# Altium schematic sheet Main.SchDoc
size A3; SheetNumber: 1; SheetTotal: 5
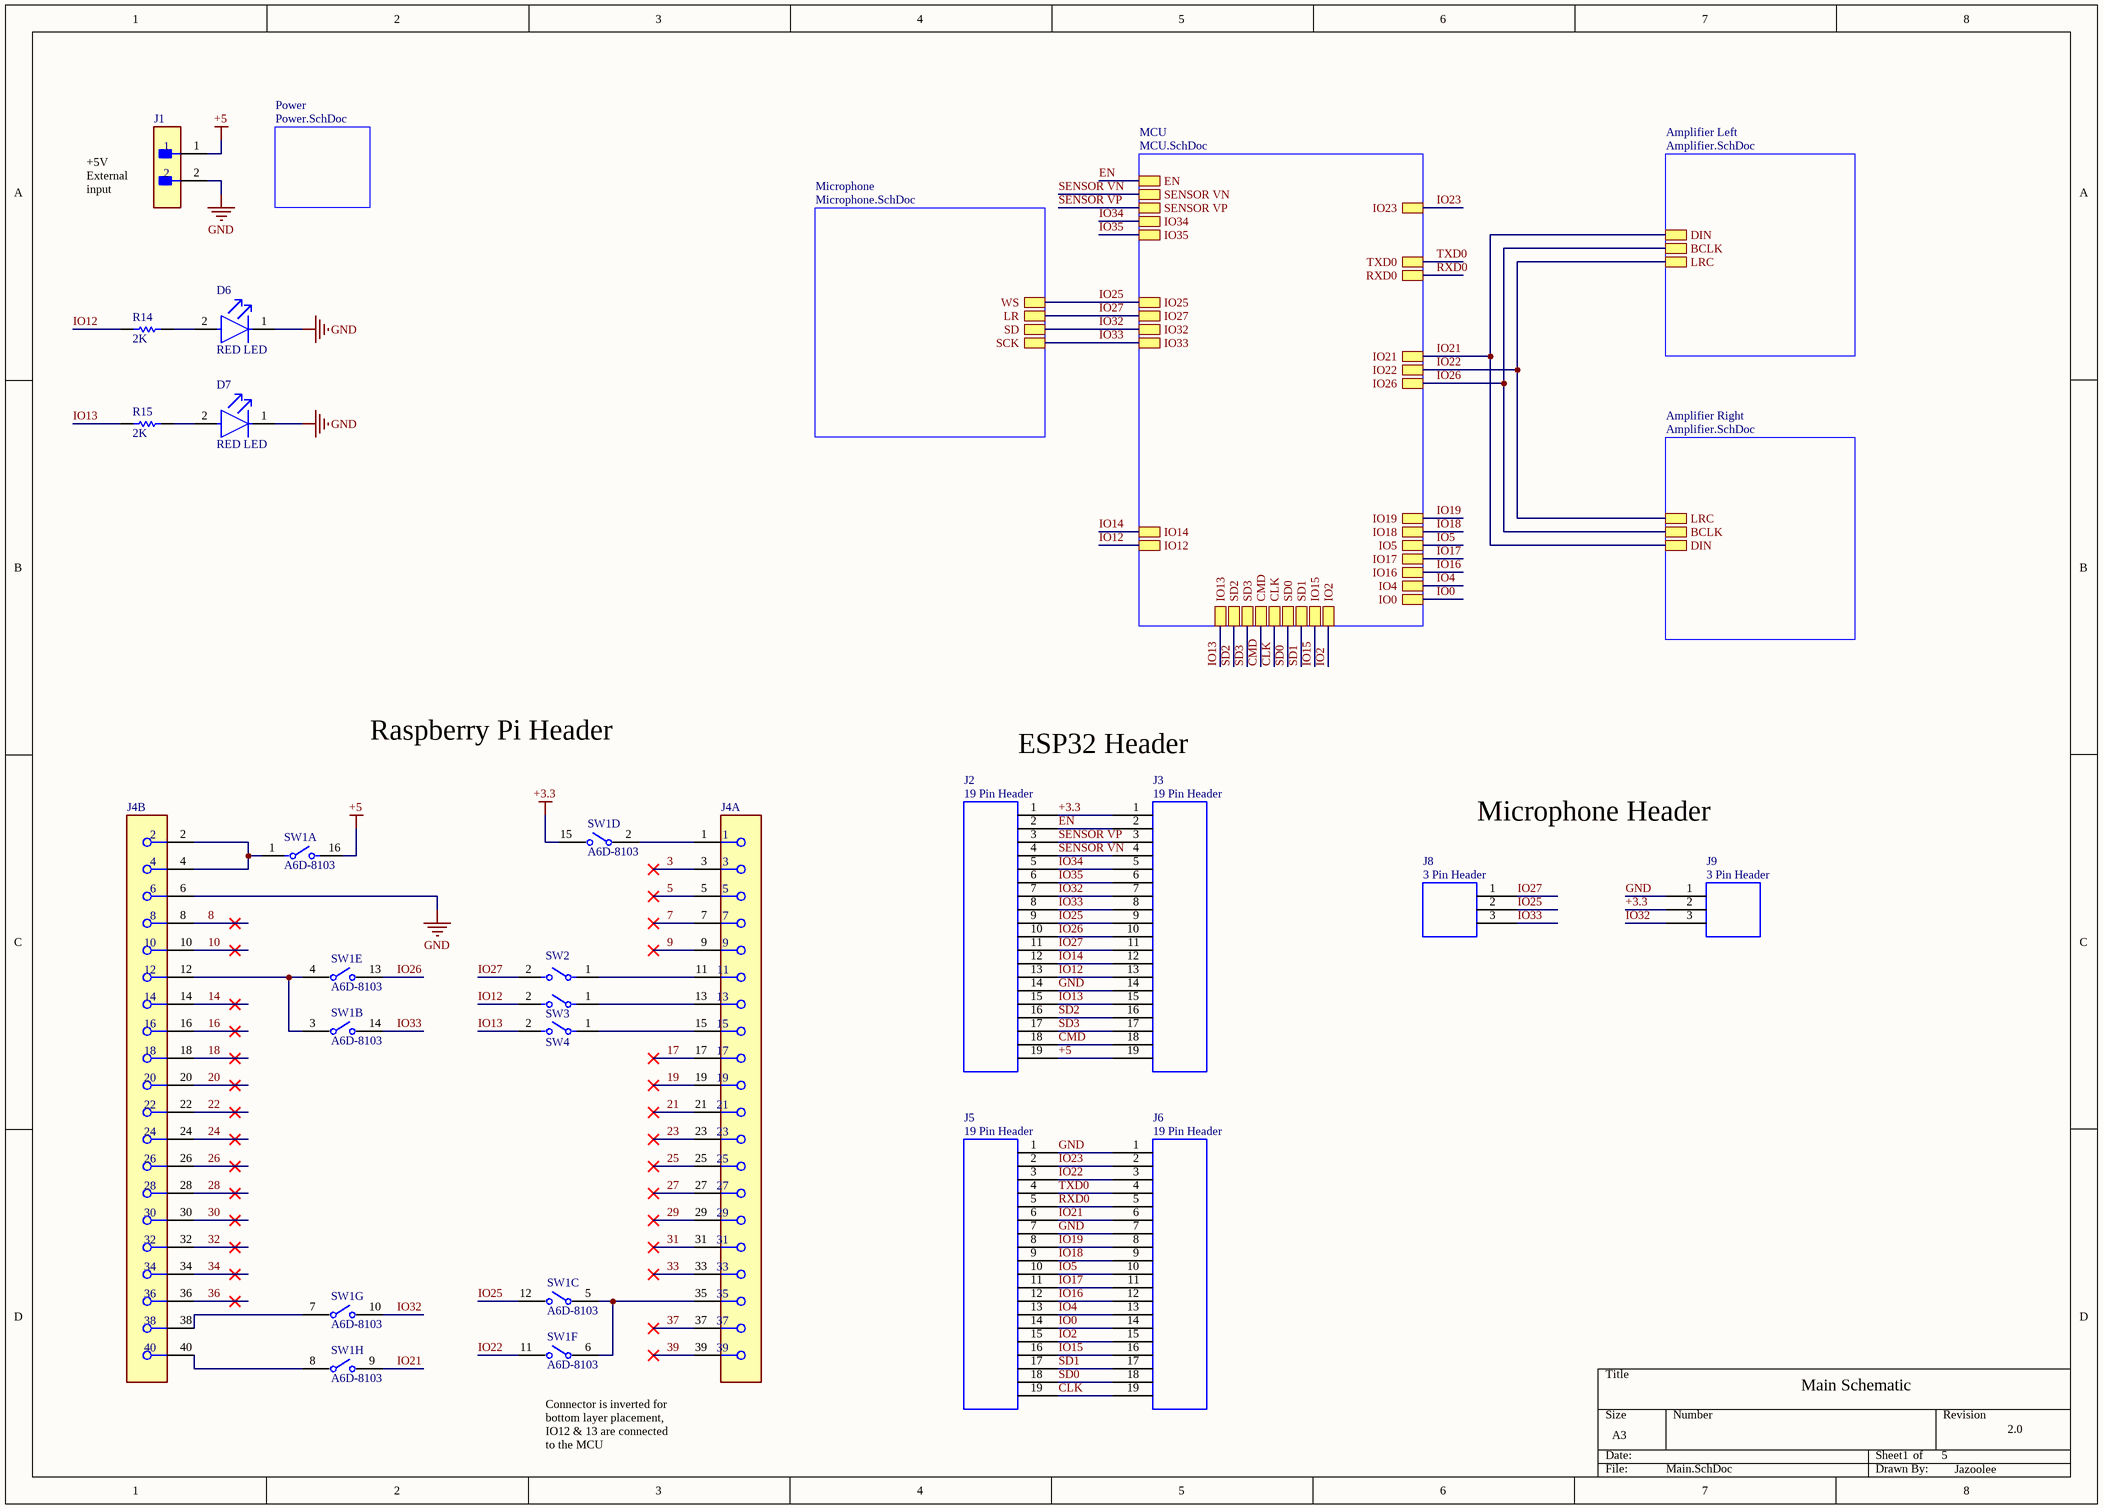
[diagram p0: Main.SchDoc]

## Parts
D6  Color: RED LED  [FP-HSMS-C150-MFG]  (hidden comment: HSMS-C150)
D7  Color: RED LED  [FP-HSMS-C150-MFG]  (hidden comment: HSMS-C150)
J1  B2B-XH-A(LF)(SN)  [FP-B2B-XH-A_LF_SN-MFG]  (value not drawn)
J2  19 Pin Header  [19 Pin Header]
J3  19 Pin Header  [19 Pin Header]
J4  SFH11-PBPC-D20-ST-BK  [FP-SFH11-PBPC-D20-ST-BK-MFG]  (value not drawn)  (parts A,B of 2)
J5  19 Pin Header  [19 Pin Header]
J6  19 Pin Header  [19 Pin Header]
J8  3 Pin Header  [3 Pin Header]
J9  3 Pin Header  [3 Pin Header]
R14  value 2K  [RESC2013X60X35LL10T20]  (hidden comment: RT0805FRE072KL)
R15  value 2K  [RESC2013X60X35LL10T20]  (hidden comment: RT0805FRE072KL)
SW1  A6D-8103  [FP-A6D-8103-MFG]  (parts A,B,C,D,E,F,G,H of 8)
SW2  BD01  [FP-BD01-MFG]  (value not drawn)
SW3  BD01  [FP-BD01-MFG]  (value not drawn)
SW4  BD01  [FP-BD01-MFG]  (value not drawn)

## Sub-sheets
Amplifier Left = Amplifier.SchDoc: LRC, BCLK, DIN
Amplifier Right = Amplifier.SchDoc: LRC, BCLK, DIN
MCU = MCU.SchDoc: IO0, IO2, IO4, IO5, IO12, IO13, IO14, IO15, IO16, IO17, IO18, IO19, IO21, IO22, IO23, IO25, IO26, IO27, IO32, IO33, IO34, IO35, CLK, CMD, EN, RXD0, TXD0, SD0, SD1, SD2, SD3, SENSOR VN, SENSOR VP
Microphone = Microphone.SchDoc: LR, WS, SCK, SD
Power = Power.SchDoc: no entries

## Nets
+3.3: J2.1 J3.1 J9.2 SW1.15
+5: J1.1 J2.19 J3.19 SW1.16
GND: D6.1(C) D7.1(C) J1.2 J2.14 J3.14 J4.6 J5.1 J5.7 J6.1 J6.7 J9.1
3: J4.3
5: J4.5
7: J4.7
8: J4.8
9: J4.9
10: J4.10
14: J4.14
16: J4.16
17: J4.17
18: J4.18
19: J4.19
20: J4.20
21: J4.21
22: J4.22
23: J4.23
24: J4.24
25: J4.25
26: J4.26
27: J4.27
28: J4.28
29: J4.29
30: J4.30
31: J4.31
32: J4.32
33: J4.33
34: J4.34
36: J4.36
37: J4.37
39: J4.39
CLK: J5.19 J6.19 ; sheet MCU/CLK
CMD: J2.18 J3.18 ; sheet MCU/CMD
EN: J2.2 J3.2 ; sheet MCU/EN
IO0: J5.14 J6.14 ; sheet MCU/IO0
IO2: J5.15 J6.15 ; sheet MCU/IO2
IO4: J5.13 J6.13 ; sheet MCU/IO4
IO5: J5.10 J6.10 ; sheet MCU/IO5
IO12: J2.13 J3.13 R14.2 SW3.2 ; sheet MCU/IO12
IO13: J2.15 J3.15 R15.2 SW4.2 ; sheet MCU/IO13
IO14: J2.12 J3.12 ; sheet MCU/IO14
IO15: J5.16 J6.16 ; sheet MCU/IO15
IO16: J5.12 J6.12 ; sheet MCU/IO16
IO17: J5.11 J6.11 ; sheet MCU/IO17
IO18: J5.9 J6.9 ; sheet MCU/IO18
IO19: J5.8 J6.8 ; sheet MCU/IO19
IO21: J5.6 J6.6 SW1.9 ; sheet MCU/IO21, sheet Amplifier Left/DIN, sheet Amplifier Right/DIN
IO22: J5.3 J6.3 SW1.11 ; sheet MCU/IO22, sheet Amplifier Left/LRC, sheet Amplifier Right/LRC
IO23: J5.2 J6.2 ; sheet MCU/IO23
IO25: J2.9 J3.9 J8.2 SW1.12 ; sheet MCU/IO25, sheet Microphone/WS
IO26: J2.10 J3.10 SW1.13 ; sheet MCU/IO26, sheet Amplifier Left/BCLK, sheet Amplifier Right/BCLK
IO27: J2.11 J3.11 J8.1 SW2.2 ; sheet MCU/IO27, sheet Microphone/LR
IO32: J2.7 J3.7 J9.3 SW1.10 ; sheet MCU/IO32, sheet Microphone/SD
IO33: J2.8 J3.8 J8.3 SW1.14 ; sheet MCU/IO33, sheet Microphone/SCK
IO34: J2.5 J3.5 ; sheet MCU/IO34
IO35: J2.6 J3.6 ; sheet MCU/IO35
RXD0: J5.5 J6.5 ; sheet MCU/RXD0
SD0: J5.18 J6.18 ; sheet MCU/SD0
SD1: J5.17 J6.17 ; sheet MCU/SD1
SD2: J2.16 J3.16 ; sheet MCU/SD2
SD3: J2.17 J3.17 ; sheet MCU/SD3
SENSOR VN: J2.4 J3.4 ; sheet MCU/SENSOR VN
SENSOR VP: J2.3 J3.3 ; sheet MCU/SENSOR VP
TXD0: J5.4 J6.4 ; sheet MCU/TXD0
NetD6_2: D6.2(A) R14.1
NetD7_2: D7.2(A) R15.1
NetJ4_1: J4.1 SW1.2
NetJ4_2: J4.2 J4.4 SW1.1
NetJ4_11: J4.11 SW2.1
NetJ4_12: J4.12 SW1.3 SW1.4
NetJ4_13: J4.13 SW3.1
NetJ4_15: J4.15 SW4.1
NetJ4_35: J4.35 SW1.5 SW1.6
NetJ4_38: J4.38 SW1.7
NetJ4_40: J4.40 SW1.8

## Notes on the sheet
- (near J1) +5V External input
- Raspberry Pi Header
- ESP32 Header
- Microphone Header
- Main Schematic
- Connector is inverted for bottom layer placement, IO12 & 13 are connected to the MCU
- 1
- 5
- 2.0
- Jazoolee

## Library data of the parts
D6 D7 = CMP-21615-000001-1: LED RED; Luminous Intensity: 10mcd; Power Dissipation: 65mW; Viewing Angle: 170°; Number of Elements: 1; Forward Current: 20mA; Lens Color: White; Lens Style: Rectangular; Wavelength: 626nm; Forward Voltage: 2.1V; Lens Transparency: Diffused; Reverse Voltage: 5V; Number of Pins: 2; Lead Free: Lead Free; Width: 1.6mm; Length: 3.2mm; REACH SVHC: No SVHC; Height: 1.1mm; Depth: 1.6mm; Power Rating: 65mW; Package Quantity: 1; Illumination Color: Red; Radiation Hardening: No; Case Code (Imperial): 1206; Max Operating Temperature: 85°C; Test Current: 20mA; Case/Package: 1206; Number of LEDs: 1; Packaging: Tape and Reel; Mount: Surface Mount; Min Operating Temperature: -40°C; Case Code (Metric): 3216; Dominant Wavelength: 626nm
J1 = CMP-2000-05888-3: CONN HEADER VERT 2POS 2.5MM; Current Rating: 3A; Voltage Rating: 250V; Number of Contacts: 2; Contact Resistance: 20mR; Wire/Cable Gauge: 22AWG; Insulation Resistance: 1GR; Connector Type: Male Pin; Packaging: Bulk; Contact Material: Brass; Lead Free: Lead Free; Orientation: Straight; Contact Plating: Tin; Max Current Rating: 3A; Termination: Solder; Fastening Type: Detent; Depth: 5.75mm; Housing Material: Polyamide; REACH SVHC: No SVHC; Series: XH; Voltage Rating (AC): 250V; Number of Positions: 2; Color: Natural; Contact Type: Male Pin; Max Voltage Rating (DC): 250V; Pitch: 2.5mm; Lead Pitch: 2.5mm; Mount: Through Hole; Max Operating Temperature: 85°C; Length: 7.4mm; Max Voltage Rating (AC): 250V; Min Operating Temperature: -25°C; Number of Rows: 1; Housing Color: White
J4 = CMP-25680-000025-1: CONN HDR 40POS 0.1 GOLD PCB; Pitch: 0.1inch; Number of Positions: 40; Connector Type: Header; Color: Black; Mount: Through Hole; Number of Rows: 2; Contact Plating: Gold; Lead Free: Lead Free; Packaging: Tray; Row Spacing: 0.1inch; Termination: Solder; Package Quantity: 1
R14 R15 = CMP-2001-01475-1: Manufacturer: Yageo; Part Number: RT0805FRE072KL
SW1 = CMP-08827-000003-1: SWITCH SLIDE DIP SPST 30MA 30V; Manufacturer: Omron Electronics Inc-EMC Div; Electromechanical Life: 2000Cycles; Standoff Height: 0.7mm; Throw Configuration: 8PST; Contact Resistance: 100mΩ; Number Of Circuits: 8; ComponentLink2Description: Datasheet; Temperature: -20°C to +70°C; Mouser Description: DIP Switches / SIP Switches 8 Pins Sealed Raised Actuator; Device Class L1: Electromechanical; Device Class L3: DIP Switches; ComponentLink2URL: https://omronfs.omron.com/en_US/ecb/products/pdf/en-a6d_a6dr.pdf; Contact Current Rating: 30mA; Package: 0; Device Class L2: Switches; Temperature Range Low: -20°C; Ambient Temperature Range Low: -20°C; Lead Free: Yes; Category: Switch; Automotive: No; Digikey Description: SWITCH SLIDE DIP SPST 30MA 30V; Octopart: https://octopart.com/a6d-8103-omron-134189; Temperature Range High: +70°C; Ambient Temperature Range High: +70°C; RoHS: TRUE; Manufacturer Part Number: A6D-8103; Mount: Through Hole
SW2-SW4 = CMP-10033-000004-1: SWITCH SLIDE DIP SPST 100MA 5V; Max Voltage Rating (DC): 25V; Contact Current Rating: 25mA; Pitch: 0.1inch; Number of Circuits: 1; Actuator Material: Nylon; Life (Cycles): 10000Cycles; Body Material: PBT; Approvals: UL; Actuator Type: Slide (Standard); Washable: Yes; Actuator Length: 0.9mm; Capacitance: 5pF; Length: 0.18inch; Lead Free: Lead Free; Material: Nylon; Termination: PC Pin; Orientation: Straight; Throw Configuration: SPST; Case/Package: DIP; Package Quantity: 115; Packaging: Rail/Tube; Number of Positions: 1; Max Operating Temperature: 85°C; Terminal Pitch: 2.54mm; Mount: Through Hole; Min Operating Temperature: -40°C; RoHS Compliant: Yes; Depth: 9.65mm; Electrical Life: 10000Cycles; Series: BD; Contact Material: Bronze; Max Current Rating: 100mA; Current Rating: 100mA; Mechanical Life: 10000Cycles; Number of Poles: 1; REACH SVHC: No SVHC; Contact Plating: Gold; Radiation Hardening: No; Width: 9.65mm; Voltage Rating (DC): 5V